# EAGLE schematic LSM330DLC (EAGLE 7.1.0)
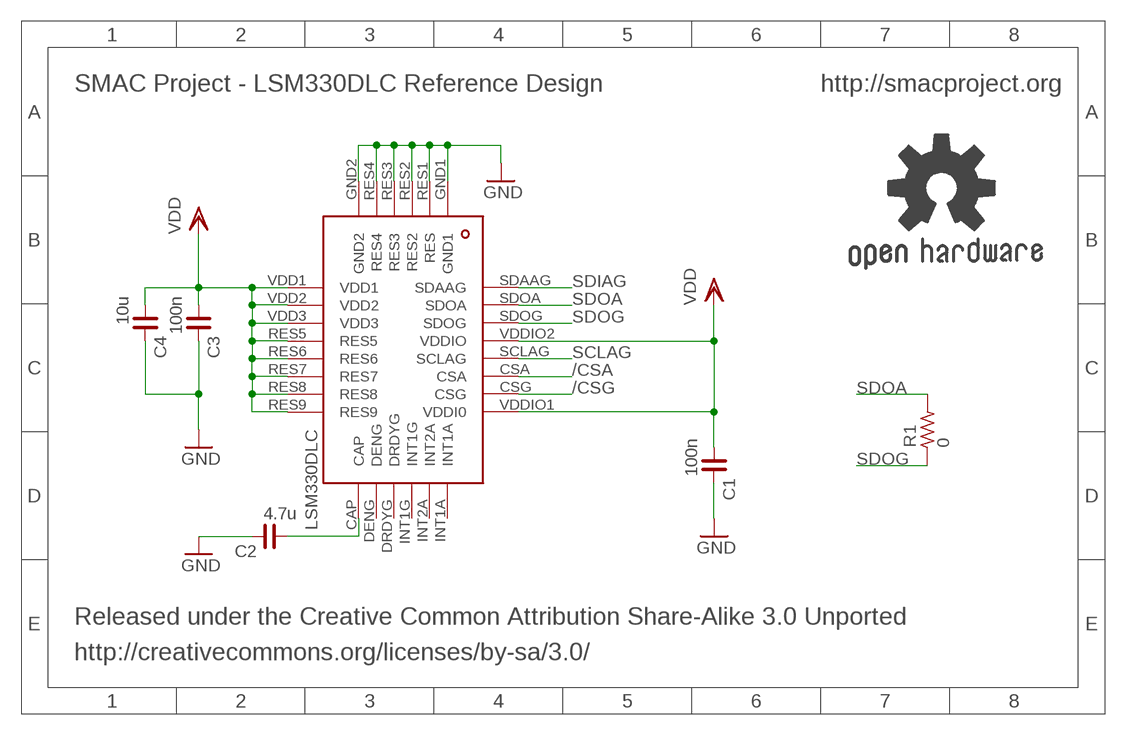
[diagram p0: schematic, sheet 1]

## Parts
C1  100n  C_0402  [C0402]
C2  4.7u  C_0402  [C0402]
C3  100n  C_0402  [C0402]
C4  10u  C_0402  [C0402]
GOLD_ORB_SM2  OSHWLOGO_REF_SM  [OSHW2REF]
IC1  LSM330DLC  [LSM330DLC]
R1  0  R_0402  [R0402]

## Nets
/CSA: IC1.CSA
/CSG: IC1.CSG
GND: C1.2 C2.2 C3.2 C4.2 IC1.GND1 IC1.GND2 IC1.RES1(RES) IC1.RES2 IC1.RES3 IC1.RES4
N$5: C2.1 IC1.CAP
SCLAG: IC1.SCLAG
SDIAG: IC1.SDAAG
SDOA: IC1.SDOA R1.2
SDOG: IC1.SDOG R1.1
VDD: C1.1 C3.1 C4.1 IC1.RES5 IC1.RES6 IC1.RES7 IC1.RES8 IC1.RES9 IC1.VDD1 IC1.VDD2 IC1.VDD3 IC1.VDDIO1(VDDI0) IC1.VDDIO2(VDDIO)
Unconnected: IC1.DENG IC1.DRDYG IC1.INT1A IC1.INT1G IC1.INT2A

## Notes on the sheet
- SMAC Project - LSM330DLC Reference Design | http://smacproject.org
- Released under the Creative Common Attribution Share-Alike 3.0 Unported
- http://creativecommons.org/licenses/by-sa/3.0/

## Library data of the parts
C1-C4 = rc-master-smd:C_: NON-POLARIZED CAP
GOLD_ORB_SM2 = bfl:OSHWLOGO: These are Open-Source Hardware logos.
IC1 = LSM330DLC:LSM330DLC
R1 = rc-master-smd:R_: RESISTOR